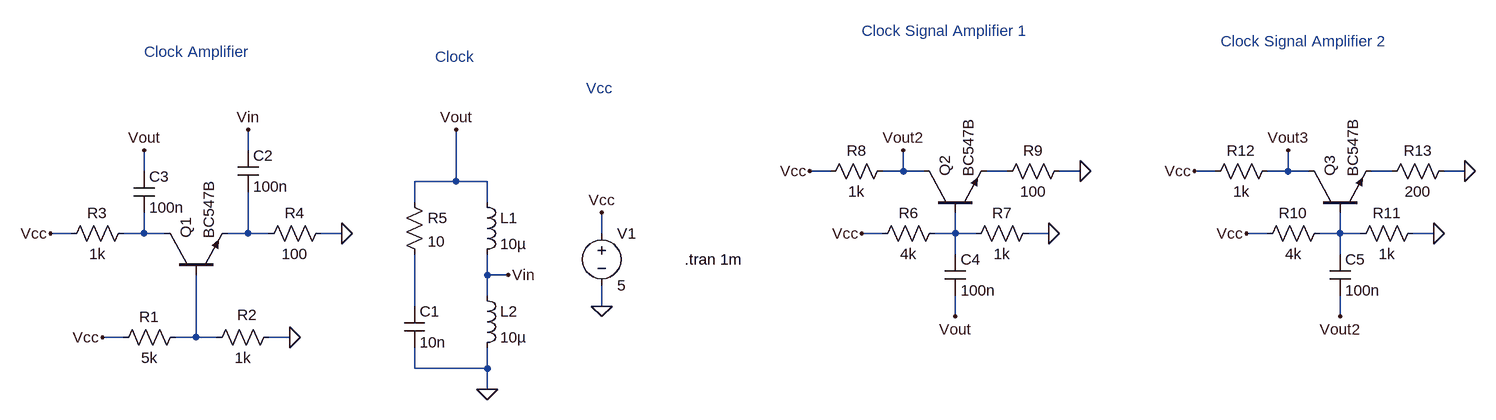
[diagram p0: schematic LCTankOscillator-v1.asc]
LCTankOscillator-v1.asc, the LTspice schematic file:
Version 4
SHEET 1 1764 680
WIRE -128 -32 -128 -64
WIRE -288 0 -288 -32
WIRE 768 0 736 0
WIRE 880 0 880 -32
WIRE 880 0 848 0
WIRE 912 0 880 0
WIRE 1040 0 1008 0
WIRE 1152 0 1120 0
WIRE 1360 0 1328 0
WIRE 1472 0 1472 -32
WIRE 1472 0 1440 0
WIRE 1504 0 1472 0
WIRE 1632 0 1600 0
WIRE 1744 0 1712 0
WIRE 192 16 192 -64
WIRE 192 16 128 16
WIRE 240 16 192 16
WIRE 128 48 128 16
WIRE 240 48 240 16
WIRE -400 96 -432 96
WIRE -288 96 -288 64
WIRE -288 96 -320 96
WIRE -256 96 -288 96
WIRE -128 96 -128 32
WIRE -128 96 -160 96
WIRE -96 96 -128 96
WIRE 16 96 -16 96
WIRE 416 96 416 64
WIRE 848 96 816 96
WIRE 960 96 960 64
WIRE 960 96 928 96
WIRE 992 96 960 96
WIRE 1104 96 1072 96
WIRE 1440 96 1408 96
WIRE 1552 96 1552 64
WIRE 1552 96 1520 96
WIRE 1584 96 1552 96
WIRE 1696 96 1664 96
WIRE 960 128 960 96
WIRE 1552 128 1552 96
WIRE 240 160 240 128
WIRE 272 160 240 160
WIRE 240 192 240 160
WIRE 128 208 128 128
WIRE 416 208 416 176
WIRE 960 224 960 192
WIRE 1552 224 1552 192
WIRE -320 256 -352 256
WIRE -208 256 -208 160
WIRE -208 256 -240 256
WIRE -176 256 -208 256
WIRE -64 256 -96 256
WIRE 128 304 128 272
WIRE 240 304 240 272
WIRE 240 304 128 304
WIRE 240 336 240 304
FLAG 240 336 0
FLAG 192 -64 Vout
FLAG -288 -32 Vout
FLAG 272 160 Vin
FLAG -128 -64 Vin
FLAG 416 208 0
FLAG 416 64 Vcc
FLAG -432 96 Vcc
FLAG 16 96 0
FLAG -64 256 0
FLAG -352 256 Vcc
FLAG 816 96 Vcc
FLAG 736 0 Vcc
FLAG 1152 0 0
FLAG 1104 96 0
FLAG 960 224 Vout
FLAG 880 -32 Vout2
FLAG 1408 96 Vcc
FLAG 1328 0 Vcc
FLAG 1744 0 0
FLAG 1696 96 0
FLAG 1552 224 Vout2
FLAG 1472 -32 Vout3
SYMBOL cap 112 208 R0
SYMATTR InstName C1
SYMATTR Value 10n
SYMBOL ind 224 32 R0
SYMATTR InstName L1
SYMATTR Value 10µ
SYMBOL ind 224 176 R0
SYMATTR InstName L2
SYMATTR Value 10µ
SYMBOL npn -256 160 R270
SYMATTR InstName Q1
SYMATTR Value BC547B
SYMBOL res -224 240 R90
WINDOW 0 0 56 VBottom 2
WINDOW 3 32 56 VTop 2
SYMATTR InstName R1
SYMATTR Value 5k
SYMBOL res -80 240 R90
WINDOW 0 -3 49 VBottom 2
WINDOW 3 32 56 VTop 2
SYMATTR InstName R2
SYMATTR Value 1k
SYMBOL voltage 416 80 R0
WINDOW 123 0 0 Left 0
WINDOW 39 0 0 Left 0
SYMATTR InstName V1
SYMATTR Value 5
SYMBOL res -304 80 R90
WINDOW 0 0 56 VBottom 2
WINDOW 3 32 56 VTop 2
SYMATTR InstName R3
SYMATTR Value 1k
SYMBOL res 0 80 R90
WINDOW 0 0 56 VBottom 2
WINDOW 3 32 56 VTop 2
SYMATTR InstName R4
SYMATTR Value 100
SYMBOL cap -144 -32 R0
SYMATTR InstName C2
SYMATTR Value 100n
SYMBOL cap -304 0 R0
SYMATTR InstName C3
SYMATTR Value 100n
SYMBOL res 112 32 R0
SYMATTR InstName R5
SYMATTR Value 10
SYMBOL npn 912 64 R270
SYMATTR InstName Q2
SYMATTR Value BC547B
SYMBOL res 944 80 R90
WINDOW 0 0 56 VBottom 2
WINDOW 3 32 56 VTop 2
SYMATTR InstName R6
SYMATTR Value 4k
SYMBOL res 1088 80 R90
WINDOW 0 0 56 VBottom 2
WINDOW 3 32 56 VTop 2
SYMATTR InstName R7
SYMATTR Value 1k
SYMBOL res 864 -16 R90
WINDOW 0 0 56 VBottom 2
WINDOW 3 32 56 VTop 2
SYMATTR InstName R8
SYMATTR Value 1k
SYMBOL res 1136 -16 R90
WINDOW 0 0 56 VBottom 2
WINDOW 3 32 56 VTop 2
SYMATTR InstName R9
SYMATTR Value 100
SYMBOL cap 944 128 R0
SYMATTR InstName C4
SYMATTR Value 100n
SYMBOL npn 1504 64 R270
SYMATTR InstName Q3
SYMATTR Value BC547B
SYMBOL res 1536 80 R90
WINDOW 0 0 56 VBottom 2
WINDOW 3 32 56 VTop 2
SYMATTR InstName R10
SYMATTR Value 4k
SYMBOL res 1680 80 R90
WINDOW 0 0 56 VBottom 2
WINDOW 3 32 56 VTop 2
SYMATTR InstName R11
SYMATTR Value 1k
SYMBOL res 1456 -16 R90
WINDOW 0 0 56 VBottom 2
WINDOW 3 32 56 VTop 2
SYMATTR InstName R12
SYMATTR Value 1k
SYMBOL res 1728 -16 R90
WINDOW 0 0 56 VBottom 2
WINDOW 3 32 56 VTop 2
SYMATTR InstName R13
SYMATTR Value 200
SYMBOL cap 1536 128 R0
SYMATTR InstName C5
SYMATTR Value 100n
TEXT 544 136 Left 2 !.tran 1m
TEXT 816 -216 Left 2 ;Clock Signal Amplifier 1
TEXT 1368 -200 Left 2 ;Clock Signal Amplifier 2
TEXT -288 -184 Left 2 ;Clock Amplifier
TEXT 160 -176 Left 2 ;Clock
TEXT 392 -128 Left 2 ;Vcc

The netlist it stands for:
* LCTankOscillator-v1.asc
C1 N007 0 10n
L1 Vout Vin 10µ
L2 Vin 0 10µ
Q1 N003 N008 N004 0 BC547B
R1 N008 Vcc 5k
R2 0 N008 1k
V1 Vcc 0 5
R3 N003 Vcc 1k
R4 0 N004 100
C2 Vin N004 100n
C3 Vout N003 100n
R5 Vout N007 10
Q2 Vout2 N005 N001 0 BC547B
R6 N005 Vcc 4k
R7 0 N005 1k
R8 Vout2 Vcc 1k
R9 0 N001 100
C4 N005 Vout 100n
Q3 Vout3 N006 N002 0 BC547B
R10 N006 Vcc 4k
R11 0 N006 1k
R12 Vout3 Vcc 1k
R13 0 N002 200
C5 N006 Vout2 100n
.model NPN NPN
.model PNP PNP
.lib standard.bjt
.tran 1m
* Clock Signal Amplifier 1
* Clock Signal Amplifier 2
* Clock Amplifier
* Clock
* Vcc
.backanno
.end